# EAGLE design Swig2 (EAGLE 7.1.0)
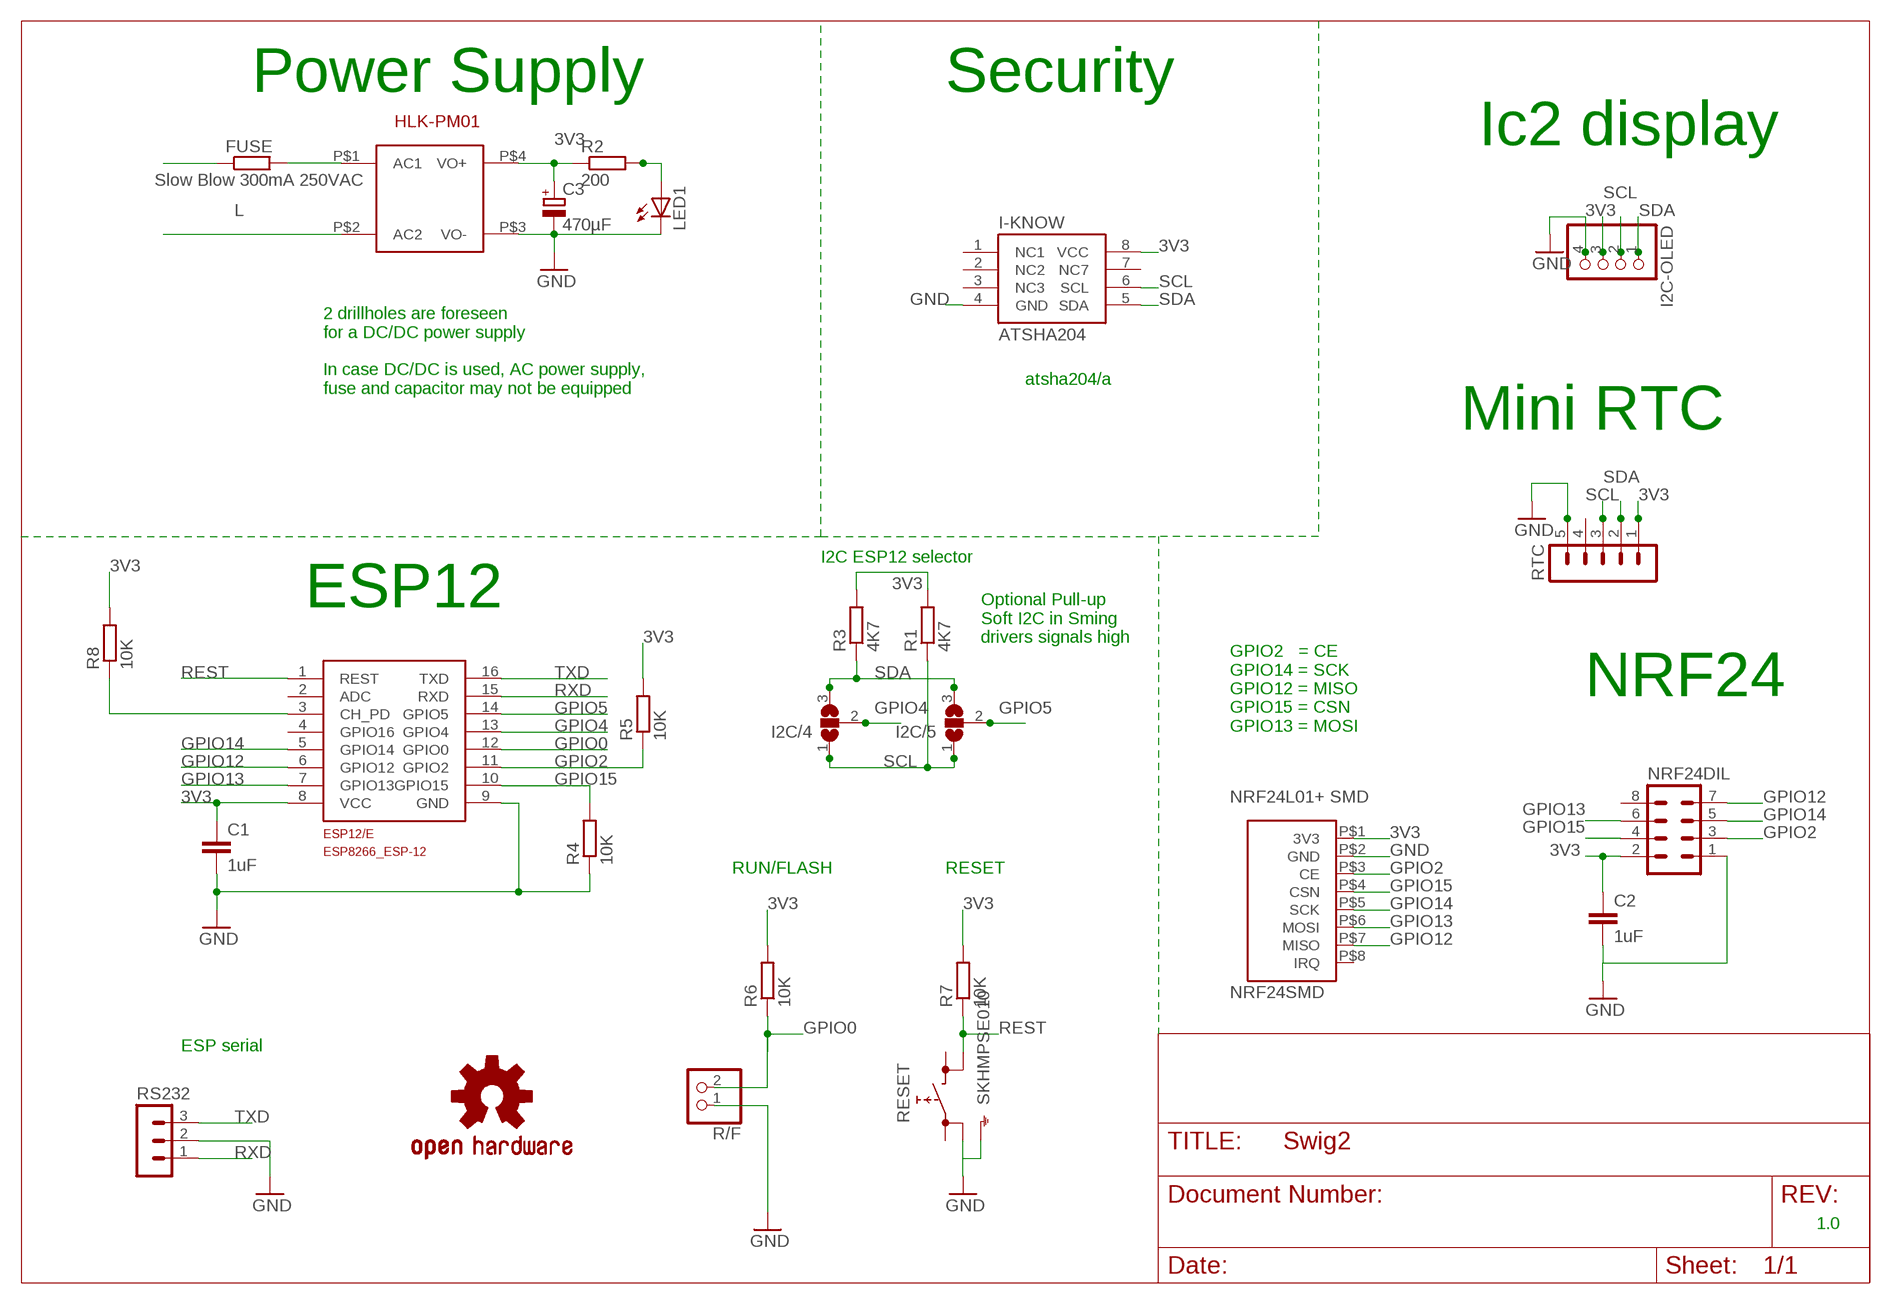
[diagram p0: schematic, sheet 1]

## Parts
C1  1uF  C-EUC0805  [C0805]
C2  1uF  C-EUC0805  [C0805]
C3  470µF  CPOL-EUE5-8.5  [E5-8,5]
ESP12/E  ESP8266-12GPIO04/05_CORRECTED  [ESP8266-ESP12]
FUSE  Slow Blow 300mA 250VAC  R-EU_0411/3V  [0411V]
HLK-PM01  HLK-PM01  [HLK-PM01]
I2C-OLED  PINHD-1X4  [1X04]
I2C/4  SJ2W  [SJ_2]
I2C/5  SJ2W  [SJ_2]
I-KNOW  ATSHA204  [SOIC8]
LED1  LED5MM  [LED5MM]
LOGO2  OSHW-LOGOS  [OSHW-LOGO-S]
NRF24DIL  MA04-2  [MA04-2]
NRF24SMD  NRF24L01+SMD  [NRF24L01+SMD]
R1  4K7  R-EU_R0805  [R0805]
R2  200  R-EU_R0805  [R0805]
R3  4K7  R-EU_R0805  [R0805]
R4  10K  R-EU_R0805  [R0805]
R5  10K  R-EU_R0805  [R0805]
R6  10K  R-EU_R0805  [R0805]
R7  10K  R-EU_R0805  [R0805]
R8  10K  R-EU_R0805  [R0805]
R/F  PINHD-1X2  [1X02]
RESET  SKHMPSE010  [SKHMPXE010]
RS232  MA03-1  [MA03-1]
RTC  MA05-1  [MA05-1]

## Nets
3V3: C1.1 C2.1 C3.+ ESP12/E.8(VCC) HLK-PM01.P$4(VO+) I2C-OLED.3 I-KNOW.8(VCC) NRF24DIL.2 NRF24SMD.P$1(3V3) R1.2 R2.1 R3.2 R5.2 R6.2 R7.2 R8.2 RTC.1
GND [dcpower]: C1.2 C2.2 C3.- ESP12/E.9(GND) HLK-PM01.P$3(VO-) I2C-OLED.4 I-KNOW.4(GND) LED1.K(C) NRF24DIL.1 NRF24SMD.P$2(GND) R4.1 R/F.1 RESET.2(1.2) RESET.5(SH) RS232.2 RTC.5
GPIO0: ESP12/E.12(GPIO0) R6.1 R/F.2
GPIO2: ESP12/E.11(GPIO2) NRF24DIL.3 NRF24SMD.P$3(CE) R5.1
GPIO4: ESP12/E.13(GPIO4) I2C/4.2
GPIO5: ESP12/E.14(GPIO5) I2C/5.2
GPIO12: ESP12/E.6(GPIO12) NRF24DIL.7 NRF24SMD.P$7(MISO)
GPIO13: ESP12/E.7(GPIO13) NRF24DIL.6 NRF24SMD.P$6(MOSI)
GPIO14: ESP12/E.5(GPIO14) NRF24DIL.5 NRF24SMD.P$5(SCK)
GPIO15: ESP12/E.10(GPIO15) NRF24DIL.4 NRF24SMD.P$4(CSN) R4.2
L: HLK-PM01.P$2(AC2)
N$4 [acpower]: FUSE.1
N$5: FUSE.2 HLK-PM01.P$1(AC1)
N$6: ESP12/E.3(CH_PD) R8.1
N$9: LED1.A R2.2
REST: ESP12/E.1(REST) R7.1 RESET.4(2.2)
RXD: ESP12/E.15(RXD) RS232.1
SCL: I2C-OLED.2 I2C/4.1 I2C/5.1 I-KNOW.6(SCL) R1.1 RTC.3
SDA: I2C-OLED.1 I2C/4.3 I2C/5.3 I-KNOW.5(SDA) R3.1 RTC.2
TXD: ESP12/E.16(TXD) RS232.3
Unconnected: ESP12/E.2(ADC) ESP12/E.4(GPIO16) I-KNOW.1(NC1) I-KNOW.2(NC2) I-KNOW.3(NC3) I-KNOW.7(NC7) NRF24DIL.8 NRF24SMD.P$8(IRQ) RESET.1(1.1) RESET.3(2.1) RTC.4

## Notes on the sheet
- Power Supply | Security
- Ic2 display
- atsha204/a
- 2 drillholes are foreseen
  for a DC/DC power supply
  
  In case DC/DC is used, AC power supply, 
  fuse and capacitor may not be equipped
- Mini RTC
- I2C ESP12 selector
- ESP12
- Optional Pull-up
  Soft I2C in Sming
  drivers signals high
- NRF24
- GPIO2   = CE
  GPIO14 = SCK
  GPIO12 = MISO
  GPIO15 = CSN
  GPIO13 = MOSI
- RUN/FLASH | RESET
- ESP serial
- 1.0

## Library data of the parts
C1 C2 = rcl:C-EU: CAPACITOR, European symbol
C3 = rcl:CPOL-EU: POLARIZED CAPACITOR, European symbol
ESP12/E = ESP8266-ESP12:ESP8266-12: Espressif ESP8266 ESP-12 Module with GPIO04 and GPIO05 corrected.
FUSE R2 = rcl:R-EU_: RESISTOR, European symbol
HLK-PM01 = GertSanders:HLK-PM01: HI-LINK Ultra-compact power module HLK-PM01 Meet UL, CE requirements Ultra-thin, ultra-small All voltage input (AC: 90 ~ 264V) Low ripple and low noise Output overload and short circuit protection High efficiency, high power density The product is designed to meet the requirements of EMC and Safety Test Low power consumption, environmental protection, no-load loss <0.1W 100% load aging and testing
I2C-OLED = pinhead:PINHD-1X4: PIN HEADER
I2C/4 I2C/5 = jumper:SJ2W: SMD solder JUMPER
I-KNOW = cryptotronix:ATSHA204: ATSHA204
LED1 = led:LED: LED OSRAM: - CHIPLED LG R971, LG N971, LY N971, LG Q971, LY Q971, LO R971, LY R971 LH N974, LH R974 LS Q976, LO Q976, LY Q976 LO Q996 - Hyper CHIPLED LW Q18S LB Q993, LB Q99A, LB R99A - SideLED LS A670, LO A670, LY A670, LG A670, LP A670 LB A673, LV A673, LT A673, LW A673 LH A674 LY A675 LS A676, LA A676, LO A676, LY A676, LW A676 LS A679, LY A679, LG A679 - Hyper Micro SIDELED® LS Y876, LA Y876, LO Y876, LY Y876 LT Y87S - SmartLED LW L88C, LW L88S LB L89C, LB L89S, LG L890 LS L89K, LO L89K, LY L89K LS L896, LA L896, LO L896, LY L896 - TOPLED LS T670, LO T670, LY T670, LG T670, LP T670 LSG T670, LSP T670, LSY T670, LOP T670, LYG T670 LG T671, LOG T671, LSG T671 LB T673, LV T673, LT T673, LW T673 LH T674 LS T676, LA T676, LO T676, LY T676, LB T676, LH T676, LSB T676, LW T676 LB T67C, LV T67C, LT T67C, LS T67K, LO T67K, LY T67K, LW E67C LS E67B, LA E67B, LO E67B, LY E67B, LB E67C, LV E67C, LT E67C LW T67C LS T679, LY T679, LG T679 LS T770, LO T770, LY T770, LG T770, LP T770 LB T773, LV T773, LT T773, LW T773 LH T774 LS E675, LA E675, LY E675, LS T675 LS T776, LA T776, LO T776, LY T776, LB T776 LHGB T686 LT T68C, LB T68C - Hyper Mini TOPLED® LB M676 - Mini TOPLED Santana® LG M470 LS M47K, LO M47K, LY M47K Source: http://www.osram.convergy.de LUXEON: - LUMILED® LXK2-PW12-R00, LXK2-PW12-S00, LXK2-PW14-U00, LXK2-PW14-V00 LXK2-PM12-R00, LXK2-PM12-S00, LXK2-PM14-U00 LXK2-PE12-Q00, LXK2-PE12-R00, LXK2-PE12-S00, LXK2-PE14-T00, LXK2-PE14-U00 LXK2-PB12-K00, LXK2-PB12-L00, LXK2-PB12-M00, LXK2-PB14-N00, LXK2-PB14-P00, LXK2-PB14-Q00 LXK2-PR12-L00, LXK2-PR12-M00, LXK2-PR14-Q00, LXK2-PR14-R00 LXK2-PD12-Q00, LXK2-PD12-R00, LXK2-PD12-S00 LXK2-PH12-R00, LXK2-PH12-S00 LXK2-PL12-P00, LXK2-PL12-Q00, LXK2-PL12-R00 Source: www.luxeon.com KINGBRIGHT: KA-3528ASYC Source: www.kingbright.com
LOGO2 = SparkFun-Aesthetics:OSHW-LOGO: Open Source Hardware Logo This logo indicates the piece of hardware it is found on incorporates a OSHW license and/or adheres to the definition of open source hardware found here: http://freedomdefined.org/OSHW
NRF24DIL = con-lstb:MA04-2: PIN HEADER; OC_FARNELL: unknown; OC_NEWARK: unknown
NRF24SMD = NRF24L01+:NRF24L01+SMD
R1 R3-R8 = resistor:R-EU_: RESISTOR, European symbol; SPICEPREFIX: R
R/F = pinhead:PINHD-1X2: PIN HEADER
RESET = switch:SKHMP*E010: 6.2 X 6.5mm TACT Switch (SMD) Source: http://www3.alps.co.jp/WebObjects/catalog.woa/PDF/E/Switch/Tact/SKHM/SKHM.PDF
RS232 = con-lstb:MA03-1: PIN HEADER; OC_FARNELL: unknown; OC_NEWARK: unknown
RTC = con-lstb:MA05-1: PIN HEADER; OC_FARNELL: unknown; OC_NEWARK: unknown

## Net classes
1 dcpower: width 0.635 mm
2 acpower: width 2.54 mm, clearance 1.524 mm

## Board
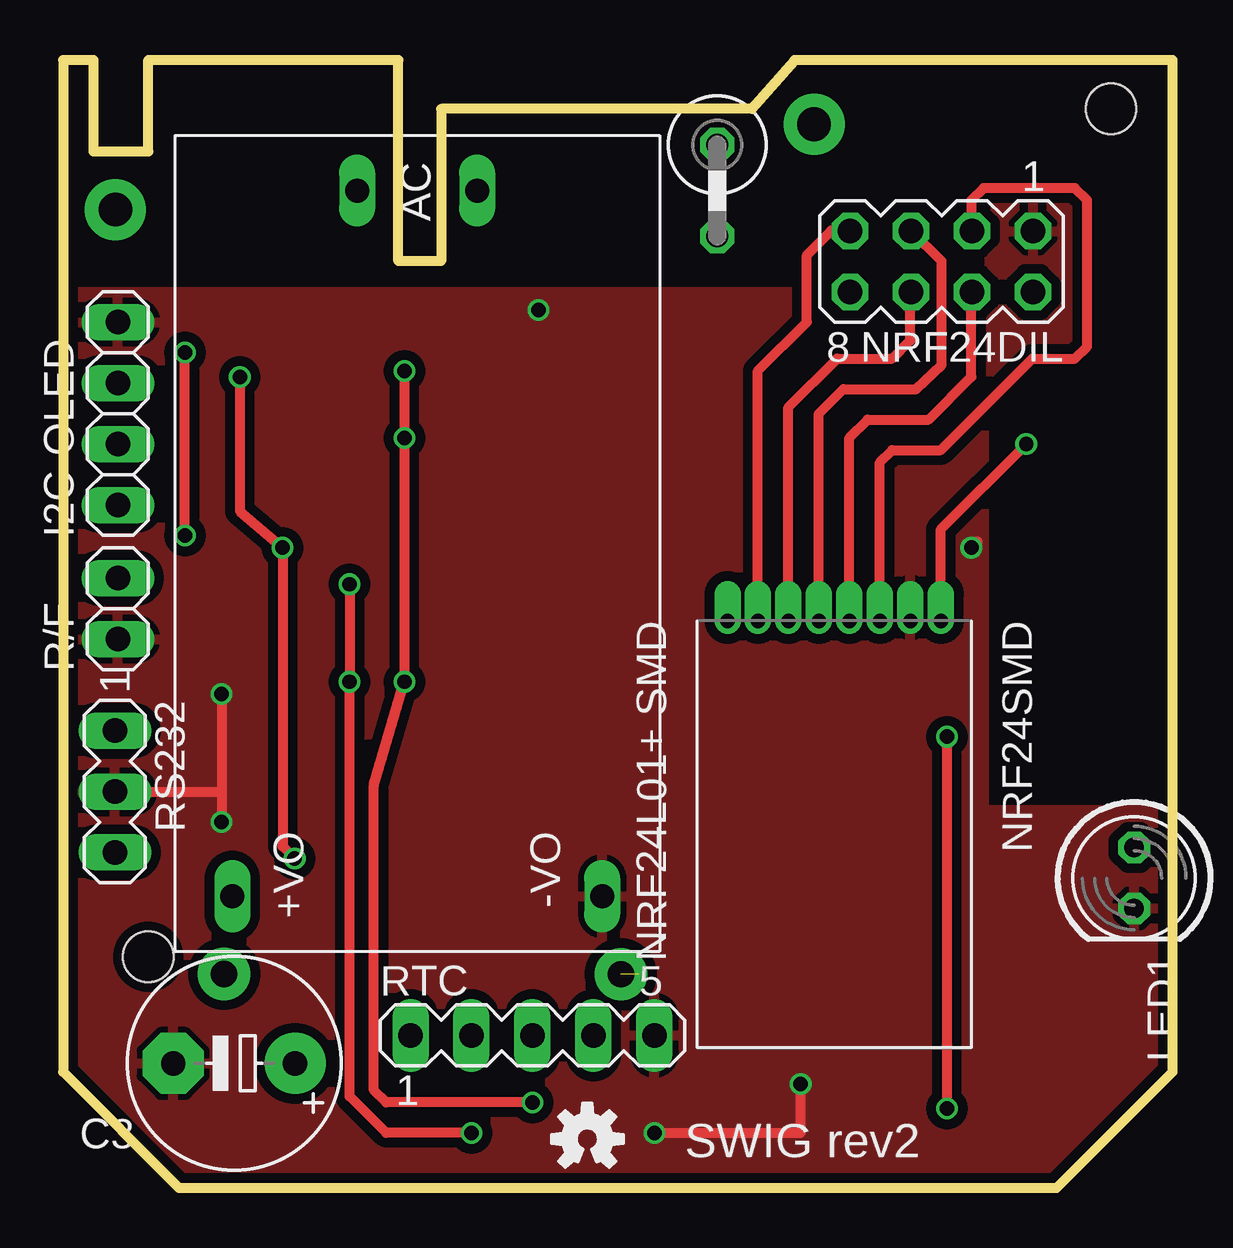
[diagram p1: board, top side]
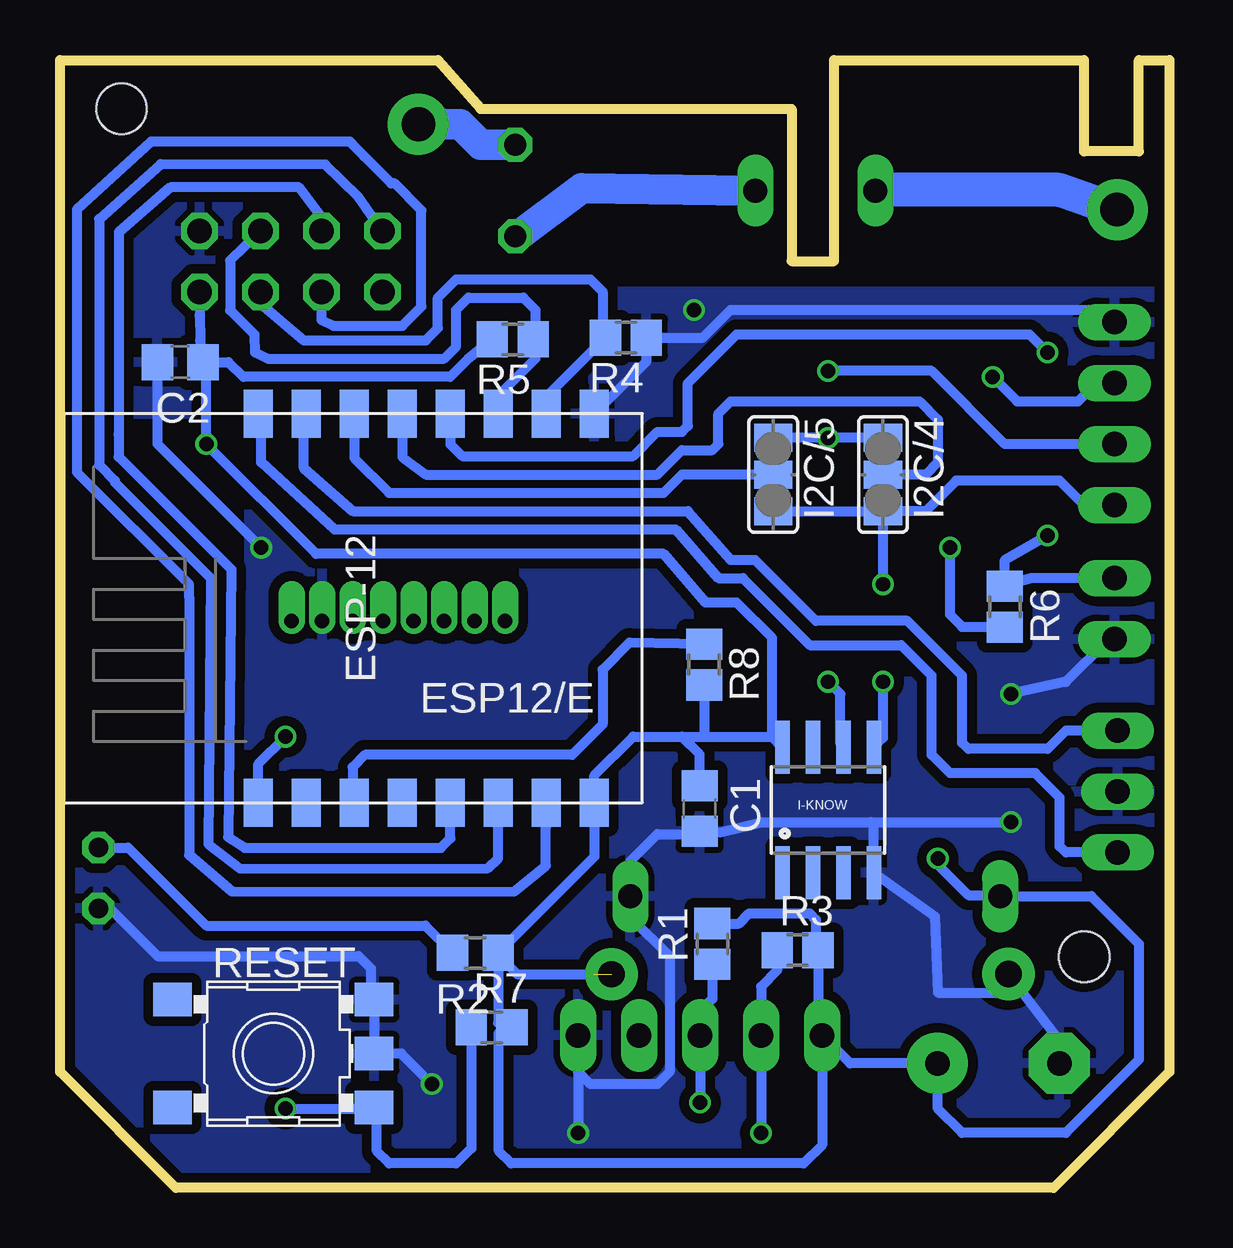
[diagram p2: board, bottom side, seen from below]

Size 46.23 x 46.99 mm. Coordinates in mm from the lower left corner, seen from the top.
Outline: 46.23,4.83 46.23,46.99 30.48,46.99 28.7,44.96 15.75,44.96 15.75,38.61 13.97,38.61 13.97,46.99 3.56,46.99 3.56,43.18 1.27,43.18 1.27,46.99 0,46.99 0,4.83 4.83,0 41.4,0 46.23,4.83
Copper layers (1*16): Top 0.035mm / dielectric 1.5mm / Bottom 0.035mm
Design rules "SeeedStudio_2layer_DRU_no_angle_20140221": minimum track width 6mil, minimum drill 12mil, track to track 6mil, track to pad 6mil, pad to pad 6mil, via to via 6mil, smd to smd 0mil, copper to edge 10mil, drill to drill 10mil, minimum pad ring 10mil, minimum via ring 6mil, stop-mask expansion 2mil, vias tented up to drill 100mil, thermal gap 10mil
Holes 2.1 mm at 43.66,44.96 3.55,9.63

### Footprints (pad centres in the part's own frame; a part is rotated, then mirrored left to right if it is on the bottom)
C0805 = smd 1.3 x 1.5: 1 -0.95,0; 2 0.95,0
E5-8,5 = drill 1.016 pad 2.54: + -2.54,0 | drill 1.016 pad 2.54 octagon: - 2.54,0
ESP8266-ESP12 = smd 2 x 1.2: 1 0,16; 2 0,14; 3 0,12; 4 0,10; 5 0,8; 6 0,6; 7 0,4; 8 0,2; 9 16.2,2; 10 16.2,4; 11 16.2,6; 12 16.2,8; 13 16.2,10; 14 16.2,12; 15 16.2,14; 16 16.2,16
0411V = drill 0.914 octagon: 1 -2.54,0; 2 1.27,0
HLK-PM01 = drill 1 long: P$1 -14.7,2.5; P$2 -14.7,-2.5; P$3 14.7,7.7; P$4 14.7,-7.7
1X04 = drill 1.016 long: 1 -3.81,0; 2 -1.27,0; 3 1.27,0; 4 3.81,0
SJ_2 = smd 1.168 x 1.6: 1 -1.524,0; 2 0,0; 3 1.524,0
SOIC8 = smd 0.61 x 2.21: 1 -1.905,-2.616; 2 -0.635,-2.616; 3 0.635,-2.616; 4 1.905,-2.616; 5 1.905,2.616; 6 0.635,2.616; 7 -0.635,2.616; 8 -1.905,2.616
LED5MM = drill 0.813 octagon: A -1.27,0; K 1.27,0
MA04-2 = drill 1.016 octagon: 1 -3.81,-1.27; 2 -3.81,1.27; 3 -1.27,-1.27; 4 -1.27,1.27; 5 1.27,-1.27; 6 1.27,1.27; 7 3.81,-1.27; 8 3.81,1.27
NRF24L01+SMD = drill 0.6 pad 1.016 offset: P$1 0,0; P$2 0,-1.27; P$3 0,-2.54; P$4 0,-3.81; P$5 0,-5.08; P$6 0,-6.35; P$7 0,-7.62; P$8 0,-8.89
R0805 = smd 1.3 x 1.5: 1 -0.85,0; 2 0.85,0
R0805' = smd 1.3 x 1.5: 1 -0.95,0; 2 0.95,0
1X02 = drill 1.016 long: 1 -1.27,0; 2 1.27,0
SKHMPXE010 = smd 1.6 x 1.4: 1 -4.2,2.25; 2 4.2,2.25; 3 -4.2,-2.25; 4 4.2,-2.25; 5 4.2,0
MA03-1 = drill 1.016 long: 1 -2.54,0; 2 0,0; 3 2.54,0
MA05-1 = drill 1.016 long: 1 -5.08,0; 2 -2.54,0; 3 0,0; 4 2.54,0; 5 5.08,0

### Placement (x,y rotation side)
C1  19.58,15.8 270 bottom
C2  41.22,34.4 180 bottom
C3  7.13,5.18 180 top
ESP12/E  21.96,16.05 90 bottom
FUSE  27.26,40.91 270 top
HLK-PM01  14.76,26.85 270 top
I2C-OLED  2.29,32.26 90 top
I2C/4  11.94,29.72 270 bottom
I2C/5  16.51,29.72 270 bottom
I-KNOW  14.22,15.75 0 bottom
LED1  44.63,12.91 270 top
LOGO2  21.84,2.03 0 top
NRF24DIL  36.6,38.59 180 top
NRF24SMD  36.58,23.62 270 top
R1  19.05,10.16 90 bottom
R2  200  [R0805']  28.92,9.79 180 bottom
R3  15.49,9.91 0 bottom
R4  22.65,35.42 180 bottom
R5  27.36,35.35 180 bottom
R6  6.86,24.21 270 bottom
R7  28.24,6.69 0 bottom
R8  19.39,21.8 270 bottom
R/F  2.29,24.13 90 top
RESET  37.34,5.59 0 bottom
RS232  2.16,16.51 270 top
RTC  19.56,6.35 0 top

### Tracks (layer width: path | path; a pad name or v marks a point on that pad's centre or on a via)
3V3  (via drill 0.6)
  Top 0.406: v7.37,33.78 7.37,28.19 v9.14,26.67 9.14,14.22 v9.65,13.72 | NRF24SMD.P$1 36.58,27.43 v40.13,30.99
  Bottom 0.406: NRF24DIL.2 40.41,36.35 40.39,35.31 40.39,34.56 C2.1 | RTC.1 13.31,5.18 C3.+ 9.65,5.17 9.65,3.3 8.64,2.29 4.32,2.29 1.27,5.33 1.27,10.16 3.26,12.15 HLK-PM01.P$4 7.1,12.19 8.38,12.19 9.65,13.46 v9.65,13.72 | RTC.1 14.48,1.78 15.24,1.02 27.43,1.02 27.94,1.52 27.94,6.47 R7.2 27.97,6.87 R2.1 23.96,13.8 ESP12/E.8 23.96,17.19 22.35,18.8 20.32,18.8 | R5.2 29.25,34.5 29.97,33.78 38.59,33.78 39.21,34.4 C2.1 | RTC.1 14.64,6.52 R3.2 14.73,9.99 14.73,11.18 14.99,11.43 17.53,11.43 17.95,11.01 R1.2 | R6.2 8.64,23.37 9.14,23.88 v9.14,26.67 | v7.37,33.78 6.35,32.77 3.81,32.77 3.3,33.27 2.54,33.27 I2C-OLED.3 | C2.1 40.13,34.27 v40.13,30.99 35.56,26.42 21.08,26.42 19.32,24.38 18.03,24.38 16.56,22.91 16.56,18.8 | 20.32,18.8 19.3,18.8 | 19.3,18.8 16.56,18.8 | 16.56,18.8 I-KNOW.8 | R8.2 19.39,18.88 19.3,18.8 | C1.1 19.58,18.06 20.32,18.8
GND  (via drill 0.6)
  Top 0.406: v6.6,20.57 6.6,16.51 | 6.6,16.51 v6.6,15.24 | v24.64,2.29 30.73,2.29 v30.73,4.32 | RS232.2 6.6,16.51 | v37.85,26.67 38.1,26.92
  Bottom 0.406: LED1.K 44.15,11.64 42.16,9.65 33.78,9.65 33.27,9.14 33.27,7.97 RESET.2 RESET.5 32,5.59 v30.73,4.32 | C3.- 4.57,5.2 4.57,6.1 6.2,8.23 6.8,8.13 9.65,8.13 9.78,11.3 I-KNOW.4 12.32,15.11 12.45,15.24 | R/F.1 2.54,22.86 4.32,21.08 v6.6,20.57 | 12.45,15.24 17.02,15.24 18.72,14.81 C1.2 19.7,14.73 21.34,14.73 22.46,13.61 HLK-PM01.P$3 22.46,11.28 20.83,9.65 20.83,4.83 21.34,4.32 24.13,4.32 24.64,4.83 RTC.5 v24.64,2.29 | 12.45,15.24 v6.6,15.24 | ESP12/E.9 21.8,34.41 R4.1 19.44,35.42 18.29,36.58 3.05,36.58 2.54,36.07 I2C-OLED.4 | C2.2 42.17,30.99 v37.85,26.67
  other vias: 19.81,36.58
  pour Bottom (isolate 0.406): 46.23,0 0,0 0,37.34 35.81,37.34 35.81,46.99 46.23,46.99 46.23,32.26 38.35,32.26 38.35,15.75 46.23,15.75
  pour Top (isolate 0.406): 0,37.34 35.81,37.34 35.81,46.99 46.23,46.99 46.23,32.26 38.35,32.26 38.35,15.75 46.23,15.75 46.23,0 0,0
GPIO0  (via drill 0.6)
  Top 0.406: v5.08,27.18 v5.08,34.8
  Bottom 0.406: v5.08,27.18 6.86,26.16 R6.1 5.76,25.4 R/F.2 | ESP12/E.12 29.96,30.98 29.46,30.48 22.35,30.48 21.34,31.5 20.32,31.5 20.07,31.75 20.07,33.53 18.03,35.56 5.84,35.56 v5.08,34.8
GPIO2
  Top 0.406: NRF24SMD.P$3 34.04,30.23 34.54,30.73 36.58,30.73 40.39,34.54 42.16,34.54 42.67,35.05 42.67,41.15 42.16,41.66 38.35,41.66 37.85,41.15 37.85,39.89 NRF24DIL.3
  Bottom 0.406: ESP12/E.11 27.96,33 26.42,34.54 26.42,35.51 R5.1 26.42,35.45 26.42,36.58 26.92,37.08 29.21,37.08 29.72,36.58 29.72,35.05 30.23,34.54 37.59,34.54 38.1,34.8 38.12,35.55 39.11,36.53 39.14,36.56 39.14,38.64 NRF24DIL.3
GPIO4
  Bottom 0.406: ESP12/E.13 31.96,30.44 30.99,29.72 21.34,29.72 20.32,30.73 19.05,30.73 18.8,30.99 18.8,32.26 18.29,32.77 10.41,32.77 9.65,32 9.65,30.23 10.16,29.72 I2C/4.2
GPIO5
  Bottom 0.406: ESP12/E.14 33.96,30.41 32.51,28.96 21.08,28.96 20.32,29.72 I2C/5.2
GPIO12
  Top 0.406: NRF24SMD.P$7 28.96,34.04 30.99,36.07 30.99,38.86 32,39.88 32.78,39.88 NRF24DIL.7
  Bottom 0.406: NRF24DIL.7 33.81,41.3 35.17,42.63 42.04,42.65 44.6,40.36 44.6,30.12 43.94,29.46 43.94,29.39 39.94,25.4 40.05,14.32 38.72,13.29 28.38,13.32 27.97,13.72 27.97,15.54 ESP12/E.6
GPIO13
  Top 0.406: NRF24SMD.P$6 30.23,32.51 32.26,34.54 34.54,34.54 35.31,35.31 35.31,37.3 NRF24DIL.6
  Bottom 0.406: NRF24DIL.6 35.34,36.17 34.83,35.91 31.97,35.91 31.17,36.71 31.17,40.72 32.29,41.84 32.43,41.84 33.56,42.97 34.07,43.5 34.15,43.59 42.44,43.59 45.52,40.77 45.52,29.82 40.85,25.15 40.85,24.62 40.85,13.87 39.07,12.35 27.32,12.34 25.98,13.42 25.98,15.01 ESP12/E.7
GPIO14
  Top 0.406: NRF24SMD.P$5 31.5,32.26 32.51,33.27 35.56,33.27 36.61,34.28 36.61,38.61 NRF24DIL.5
  Bottom 0.406: NRF24DIL.5 35.34,40.45 36.27,41.68 41.62,41.68 43.77,39.81 43.78,31.38 43.78,30.46 39.09,25.76 39.22,14.61 38.53,14.17 30.36,14.17 29.96,14.56 29.96,15.8 ESP12/E.5
GPIO15
  Top 0.406: NRF24SMD.P$4 32.77,31.24 33.53,32 36.07,32 37.85,33.78 37.85,37.3 NRF24DIL.4
  Bottom 0.406: NRF24DIL.4 37.88,36.86 36.07,35.31 30.99,35.31 30.48,35.81 30.48,37.08 29.72,37.85 24.13,37.85 23.62,37.34 23.62,35.54 R4.2 25.96,32.96 ESP12/E.10
L
  Bottom 1.27: 5.38,41.53 HLK-PM01.P$2
N$2  (via drill 1.1 pad 2.18)  (1 unrouted)
  Bottom 0.406: 27.94,9.65 27.19,8.9 23.98,8.9 23.98,8.91
  other vias: 23.25,8.9
N$3  (via drill 1.1 pad 2.18)
  other vias: 6.71,8.91
N$4
  Bottom 1.27: FUSE.1 28.7,43.45 29.55,44.3 31.26,44.3
N$5
  Bottom 1.27: HLK-PM01.P$1 17.48,41.55 24.5,41.64 27.23,39.61 FUSE.2
N$6
  Bottom 0.406: R8.1 22.5,22.71 23.62,21.59 23.62,19.3 24.89,18.03 33.53,18.03 34.04,17.53 34.04,16.13 ESP12/E.3
N$9
  Bottom 0.406: LED1.A 43.39,14.18 40.13,10.92 31.01,10.92 R2.2
N$12  (via drill 1.4 pad 2.54)
  other vias: 2.18,40.76
N$13  (via drill 1.4 pad 2.54)
  other vias: 31.3,44.31
N$14
  Bottom 1.422: 2.26,40.76 4.6,41.58 12.26,41.58 12.27,41.57
REST  (via drill 0.6)
  Top 0.406: v36.83,18.8 v36.83,3.3
  Bottom 0.406: ESP12/E.1 37.96,17.66 v36.83,18.8 | v36.83,3.3 33.17,3.3 RESET.4 33.02,3.22 33.02,1.52 32.51,1.02 29.72,1.02 29.09,1.64 R7.1
RXD
  Bottom 0.406: RS232.1 4.32,19.05 5.08,18.29 8.38,18.29 8.64,18.54 8.64,21.34 10.92,23.62 14.73,23.62 17.27,26.16 18.29,26.16 20.07,28.19 34.04,28.19 36.07,29.97 36.07,32.15 ESP12/E.15
SCL  (via drill 0.6)
  Top 0.406: v14.22,34.04 v14.22,31.24 v14.22,21.08 12.95,16.76 12.95,4.06 13.46,3.56 v19.56,3.56
  Bottom 0.406: I-KNOW.6 13.72,18.49 13.72,20.57 v14.22,21.08 | v19.56,3.56 RTC.3 19.56,7.37 19.05,7.87 R1.1 | I2C/4.1 v14.22,31.24 I2C/5.1 | v14.22,34.04 9.91,34.04 6.86,30.99 I2C-OLED.2
SDA  (via drill 0.6)
  Top 0.406: v11.94,25.15 v11.94,21.08 11.94,3.81 13.46,2.29 v17.02,2.29
  Bottom 0.406: v11.94,21.08 11.94,18.75 I-KNOW.5 | v17.02,2.29 RTC.2 17.02,8.38 16.34,9.06 R3.1 | I2C/5.3 I2C/4.3 | I2C/4.3 v11.94,25.15 | I2C-OLED.1 3.56,28.45 4.57,29.46 8.89,29.46 10.16,28.19 I2C/4.3
TXD
  Bottom 0.406: RS232.3 4.32,13.97 4.57,14.22 4.57,16.26 5.59,17.27 9.14,17.27 9.91,18.03 9.91,21.34 11.18,22.61 14.99,22.61 17.78,25.4 18.8,25.4 20.57,27.43 34.8,27.43 37.85,30.23 37.85,32.14 ESP12/E.16

### Text on the board
tPlace: SWIG rev2